# EAGLE design Water-Volume-Monitoring (EAGLE 6.3)
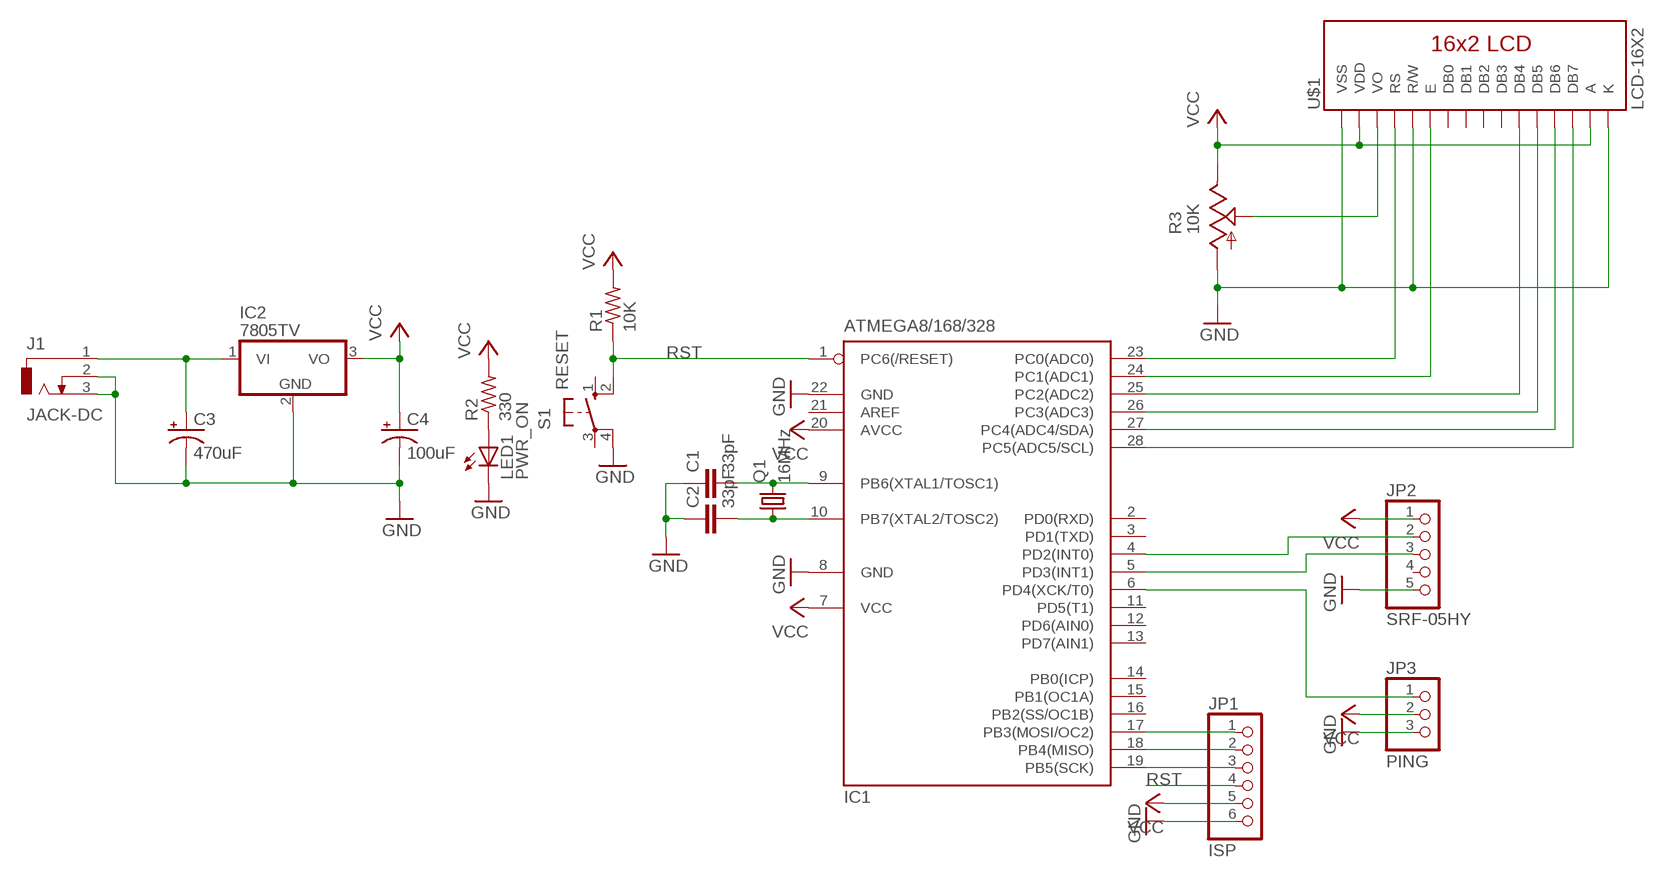
[diagram p0: schematic, sheet 1]

## Parts
C1  33pF  CAPACITOR-NONPOLAR025-024X044  [C025-024X044]
C2  33pF  CAPACITOR-NONPOLAR025-024X044  [C025-024X044]
C3  470uF  CAPACITOR-POLARE2.5-6  [E2,5-6]
C4  100uF  CAPACITOR-POLARE2.5-6  [E2,5-6]
IC1  ATMEGA8/168/328  [DIL28-3]
IC2  7805TV  [TO220V]
J1  JACK-DC  [DCJ0202]
JP1  ISP  PINHD-1X6  [1X06]
JP2  SRF-05HY  PINHD-1X5  [1X05]
JP3  PING  PINHD-1X3  [1X03]
LED1  PWR_ON  LED3MM  [LED3MM]
Q1  16MHz  CRYSTALHC49S  [HC49/S]
R1  10K  RESISTOR0207/10  [0207/10]
R2  330  RESISTOR0207/10  [0207/10]
R3  10K  TRIMPOTCA6V  [CA6V]
S1  RESET  SW-PUSHBUTTON  [B3F-10XX]
U$1  LCD-16X2  [LCD-16X2]

## Nets
GND: C1.1 C2.1 C3.- C4.- IC1.8(GND) IC1.22(GND) IC2.2(GND) J1.2 J1.3 JP1.6 JP2.5 JP3.3 LED1.K(C) R3.A S1.4(P1) U$1.1(VSS) U$1.5(R/W) U$1.16(K)
N$1: C1.2 IC1.9(PB6(XTAL1/TOSC1)) Q1.2
N$2: C2.2 IC1.10(PB7(XTAL2/TOSC2)) Q1.1
N$3: IC1.4(PD2(INT0)) JP2.2
N$4: C3.+ IC2.1(VI) J1.1
N$5: IC1.5(PD3(INT1)) JP2.3
N$6: IC1.6(PD4(XCK/T0)) JP3.1
N$8: LED1.A R2.1
N$9: R3.S U$1.3(VO)
N$10: IC1.23(PC0(ADC0)) U$1.4(RS)
N$11: IC1.24(PC1(ADC1)) U$1.6(E)
N$12: IC1.25(PC2(ADC2)) U$1.11(DB4)
N$13: IC1.26(PC3(ADC3)) U$1.12(DB5)
N$14: IC1.27(PC4(ADC4/SDA)) U$1.13(DB6)
N$15: IC1.28(PC5(ADC5/SCL)) U$1.14(DB7)
N$16: IC1.17(PB3(MOSI/OC2)) JP1.1
N$17: IC1.18(PB4(MISO)) JP1.2
N$18: IC1.19(PB5(SCK)) JP1.3
RST: IC1.1(PC6(/RESET)) JP1.4 R1.1 S1.2(S1)
VCC: C4.+ IC1.7(VCC) IC1.20(AVCC) IC2.3(VO) JP1.5 JP2.1 JP3.2 R1.2 R2.2 R3.E U$1.2(VDD) U$1.15(A)
Unconnected: IC1.2(PD0(RXD)) IC1.3(PD1(TXD)) IC1.11(PD5(T1)) IC1.12(PD6(AIN0)) IC1.13(PD7(AIN1)) IC1.14(PB0(ICP)) IC1.15(PB1(OC1A)) IC1.16(PB2(SS/OC1B)) IC1.21(AREF) JP2.4 S1.1(S) S1.3(P) U$1.7(DB0) U$1.8(DB1) U$1.9(DB2) U$1.10(DB3)

## Library data of the parts
C1 C2 = barelang-store:CAPACITOR-NONPOLAR: CAPACITOR, European symbol
C3 C4 = barelang-store:CAPACITOR-POLAR: POLARIZED CAPACITOR, American symbol
IC1 = barelang-store:ATMEGA8/168/328: MICROCONTROLLER 8 Kbytes FLASH, 1 kbytes SRAM, 512 bytes EEPROM, USART, 4-channel 10 bit ADC, 2-channel 8 bit ADC Pin compatible with Atmega48, ATMega88, ATMega168 Source: avr.lbr; OC_FARNELL: unknown; OC_NEWARK: unknown
IC2 = barelang-store:78*: Positive VOLTAGE REGULATOR Source: http://cache.national.com/ds/LM/LM78L05.pdf http://www.fairchildsemi.com/ds/LM/LM7805.pdf
J1 = barelang-store:JACK-DC: DC POWER JACK Source: DCJ0202.pdf; OC_FARNELL: unknown; OC_NEWARK: unknown
JP1 = barelang-store:PINHD-1X6: PIN HEADER
JP2 = barelang-store:PINHD-1X5: PIN HEADER
JP3 = barelang-store:PINHD-1X3: PIN HEADER
LED1 = barelang-store:LED: LED OSRAM: - CHIPLED LG R971, LG N971, LY N971, LG Q971, LY Q971, LO R971, LY R971 LH N974, LH R974 LS Q976, LO Q976, LY Q976 LO Q996 - Hyper CHIPLED LW Q18S LB Q993, LB Q99A, LB R99A - SideLED LS A670, LO A670, LY A670, LG A670, LP A670 LB A673, LV A673, LT A673, LW A673 LH A674 LY A675 LS A676, LA A676, LO A676, LY A676, LW A676 LS A679, LY A679, LG A679 - Hyper Micro SIDELED® LS Y876, LA Y876, LO Y876, LY Y876 LT Y87S - SmartLED LW L88C, LW L88S LB L89C, LB L89S, LG L890 LS L89K, LO L89K, LY L89K LS L896, LA L896, LO L896, LY L896 - TOPLED LS T670, LO T670, LY T670, LG T670, LP T670 LSG T670, LSP T670, LSY T670, LOP T670, LYG T670 LG T671, LOG T671, LSG T671 LB T673, LV T673, LT T673, LW T673 LH T674 LS T676, LA T676, LO T676, LY T676, LB T676, LH T676, LSB T676, LW T676 LB T67C, LV T67C, LT T67C, LS T67K, LO T67K, LY T67K, LW E67C LS E67B, LA E67B, LO E67B, LY E67B, LB E67C, LV E67C, LT E67C LW T67C LS T679, LY T679, LG T679 LS T770, LO T770, LY T770, LG T770, LP T770 LB T773, LV T773, LT T773, LW T773 LH T774 LS E675, LA E675, LY E675, LS T675 LS T776, LA T776, LO T776, LY T776, LB T776 LHGB T686 LT T68C, LB T68C - Hyper Mini TOPLED® LB M676 - Mini TOPLED Santana® LG M470 LS M47K, LO M47K, LY M47K Source: http://www.osram.convergy.de LUXEON: - LUMILED® LXK2-PW12-R00, LXK2-PW12-S00, LXK2-PW14-U00, LXK2-PW14-V00 LXK2-PM12-R00, LXK2-PM12-S00, LXK2-PM14-U00 LXK2-PE12-Q00, LXK2-PE12-R00, LXK2-PE12-S00, LXK2-PE14-T00, LXK2-PE14-U00 LXK2-PB12-K00, LXK2-PB12-L00, LXK2-PB12-M00, LXK2-PB14-N00, LXK2-PB14-P00, LXK2-PB14-Q00 LXK2-PR12-L00, LXK2-PR12-M00, LXK2-PR14-Q00, LXK2-PR14-R00 LXK2-PD12-Q00, LXK2-PD12-R00, LXK2-PD12-S00 LXK2-PH12-R00, LXK2-PH12-S00 LXK2-PL12-P00, LXK2-PL12-Q00, LXK2-PL12-R00 Source: www.luxeon.com KINGBRIGHT: KA-3528ASYC Source: www.kingbright.com
Q1 = barelang-store:CRYSTAL: CRYSTAL; OC_FARNELL: 1667008; OC_NEWARK: unknown
R1 R2 = barelang-store:RESISTOR: RESISTOR, American symbol
R3 = barelang-store:TRIMPOT: POTENTIOMETER
S1 = barelang-store:SW-PUSHBUTTON: OMRON SWITCH; MPN: B3F-1000; OC_FARNELL: 176432; OC_NEWARK: 36M3542
U$1 = barelang-store:LCD-16X2

## Board
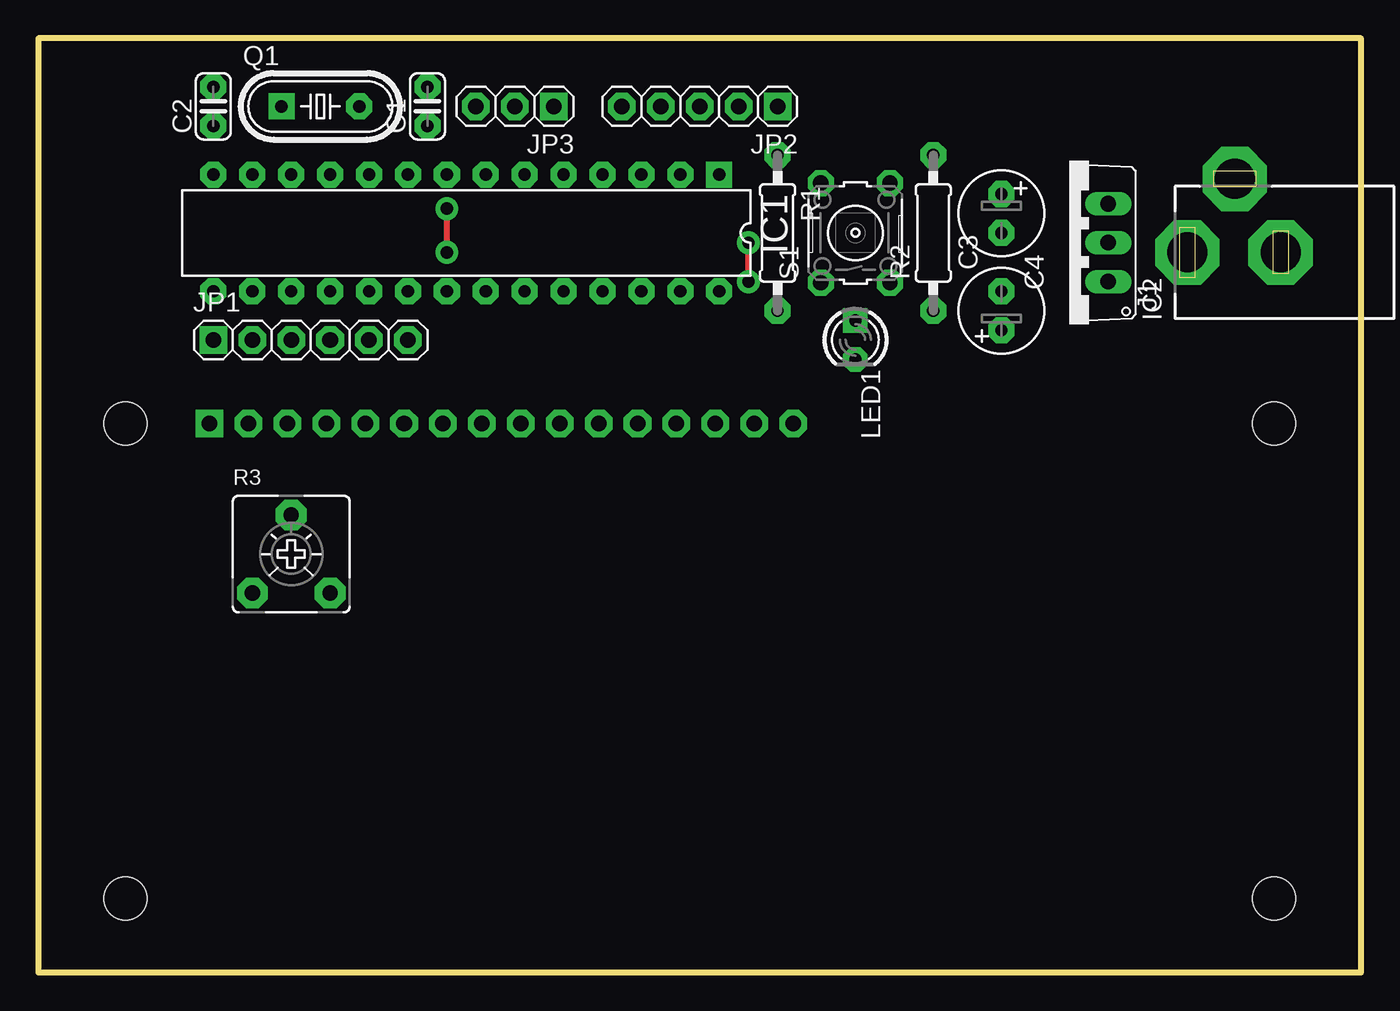
[diagram p1: board, top side]
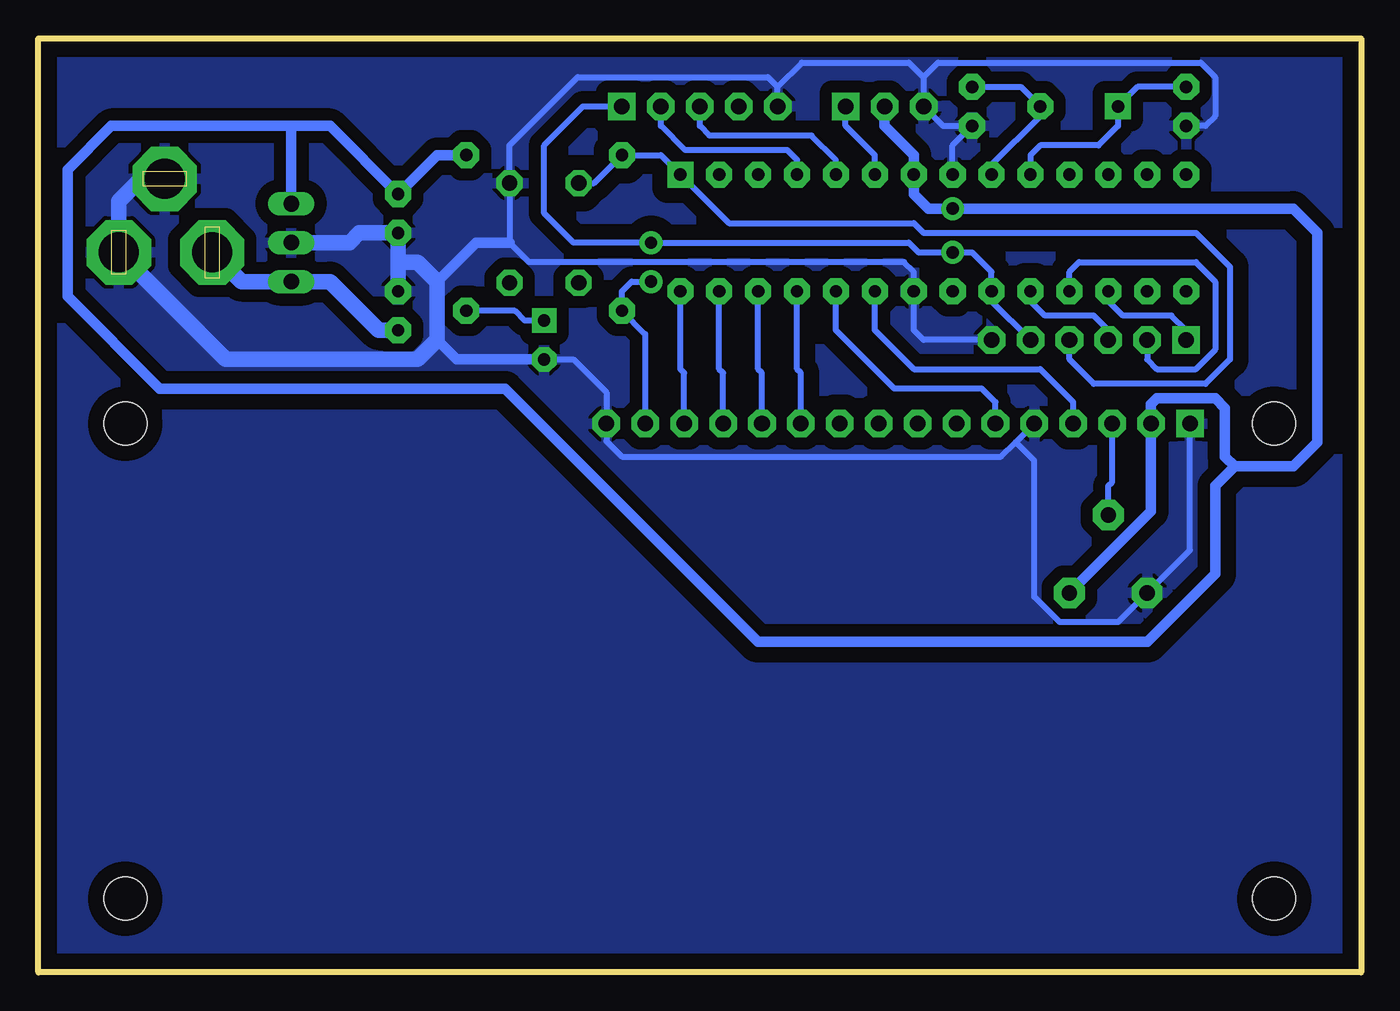
[diagram p2: board, bottom side, seen from below]

Size 86.36 x 60.96 mm. Coordinates in mm from the lower left corner, seen from the top.
Outline: 0,0 86.36,0 86.36,60.96 0,60.96 0,0
Copper layers (1*16): Top 0.035mm / dielectric 1.5mm / Bottom 0.035mm
Design rules "default": minimum track width 10mil, minimum drill 24mil, track to track 8mil, track to pad 8mil, pad to pad 8mil, via to via 8mil, smd to smd 8mil, copper to edge 40mil, drill to drill 8mil, minimum pad ring 10mil, minimum via ring 8mil, stop-mask expansion 4mil, vias tented up to drill 0mil, thermal gap 10mil

### Footprints (pad centres in the part's own frame; a part is rotated, then mirrored left to right if it is on the bottom)
C025-024X044 = drill 0.8 pad 1.7 octagon: 1 -1.27,0; 2 1.27,0
E2,5-6 = drill 0.8 pad 1.7 octagon: + -1.27,0; - 1.27,0
DIL28-3 = drill 0.8 pad 1.7 square: 1 -16.51,-3.81 | drill 0.8 pad 1.7 octagon: 2 -13.97,-3.81; 3 -11.43,-3.81; 4 -8.89,-3.81; 5 -6.35,-3.81; 6 -3.81,-3.81; 7 -1.27,-3.81; 8 1.27,-3.81; 9 3.81,-3.81; 10 6.35,-3.81; 11 8.89,-3.81; 12 11.43,-3.81; 13 13.97,-3.81; 14 16.51,-3.81; 15 16.51,3.81; 16 13.97,3.81; 17 11.43,3.81; 18 8.89,3.81; 19 6.35,3.81; 20 3.81,3.81; 21 1.27,3.81; 22 -1.27,3.81; 23 -3.81,3.81; 24 -6.35,3.81; 25 -8.89,3.81; 26 -11.43,3.81; 27 -13.97,3.81; 28 -16.51,3.81
TO220V = drill 1.016 long: 1 -2.54,-2.54; 2 0,-2.54; 3 2.54,-2.54
DCJ0202 = drill 2.6 pad 4.2 octagon: 1 0,3.1; 2 4.8,0; 3 0,-3
1X06 = drill 1.016 pad 1.8 square: 1 -6.35,0 | drill 1.016 pad 1.8 octagon: 2 -3.81,0; 3 -1.27,0; 4 1.27,0; 5 3.81,0; 6 6.35,0
1X05 = drill 1.016 pad 1.8 square: 1 -5.08,0 | drill 1.016 pad 1.8 octagon: 2 -2.54,0; 3 0,0; 4 2.54,0; 5 5.08,0
1X03 = drill 1.016 pad 1.8 square: 1 -2.54,0 | drill 1.016 pad 1.8 octagon: 2 0,0; 3 2.54,0
LED3MM = drill 0.8 pad 1.6 square: A -1.27,0 | drill 0.8 pad 1.6 octagon: K 1.27,0
HC49/S = drill 0.8 pad 1.7 square: 1 -2.54,0 | drill 0.8 pad 1.7 octagon: 2 2.54,0
0207/10 = drill 0.8 pad 1.7 octagon: 1 -5.08,0; 2 5.08,0
CA6V = drill 1 pad 2 octagon: A -2.54,-2.54; E 2.54,-2.54; S 0,2.54
B3F-10XX = drill 1 pad 1.7 octagon: 1 -3.251,2.261; 2 3.251,2.261; 3 -3.251,-2.261; 4 3.251,-2.261
LCD-16X2 = drill 1.016 pad 1.8 square: 1 -32,15.5 | drill 1.016 pad 1.8 octagon: 2 -29.46,15.5; 3 -26.92,15.5; 4 -24.38,15.5; 5 -21.84,15.5; 6 -19.3,15.5; 7 -16.76,15.5; 8 -14.22,15.5; 9 -11.68,15.5; 10 -9.14,15.5; 11 -6.6,15.5; 12 -4.06,15.5; 13 -1.52,15.5; 14 1.02,15.5; 15 3.56,15.5; 16 6.1,15.5 | hole 2.8: -37.5,15.5; -37.5,-15.5; 37.5,15.5; 37.5,-15.5

### Placement (x,y rotation side)
C1  25.4,56.52 90 top
C2  11.43,56.52 90 top
C3  62.87,43.18 90 top
C4  62.87,49.53 270 top
IC1  27.94,48.26 180 top
IC2  67.31,47.62 90 top
J1  78.11,46.99 90 top
JP1  17.78,41.27 0 top
JP2  43.18,56.52 180 top
JP3  31.11,56.52 180 top
LED1  53.34,41.27 270 top
Q1  18.41,56.52 0 top
R1  48.26,48.26 270 top
R2  58.42,48.26 90 top
R3  16.51,27.3 0 top
S1  53.34,48.26 90 top
U$1  43.18,20.32 0 top

### Tracks (layer width: path | path; a pad name or v marks a point on that pad's centre or on a via)
GND
  Bottom 0.4: C2.1 10.16,55.24 9.53,55.88 9.53,58.42 10.48,59.37 27.62,59.37 28.57,58.42 | U$1.1 11.18,27.55 R3.A 15.88,22.86 19.68,22.86 21.34,24.52 21.34,33.41 22.55,34.61 | IC1.8 26.67,53.98 C1.1 27.3,55.24 JP3.3 28.57,58.42 | 28.57,58.42 29.53,59.37 36.51,59.37 38.1,57.78 | LED1.K 51.44,40.01 49.28,37.85 U$1.16 49.28,34.67 48.26,33.66 23.5,33.66 22.55,34.61 | 22.55,34.61 U$1.5 | JP1.6 28.57,41.27 29.21,41.91 IC1.22 29.21,45.72 29.84,46.35 54.33,46.35 55.6,47.62 S1.4 55.6,53.98 51.16,58.42 38.73,58.42 38.1,57.78 | JP2.5 38.1,57.78
  Bottom 0.7: LED1.K 59.05,40.01 60.33,41.27 | 55.6,47.62 57.78,47.62 60.33,45.09
  Bottom 1: 62.87,46.35 61.59,46.35 60.33,45.09 60.33,41.27 61.59,40.01 74.12,40.01 J1.3 81.11,50.34 79.66,51.79 J1.2 | 62.87,46.35 C4.- 65.41,48.26 66.04,47.62 IC2.2 | 62.87,46.35 C3.-
  pour Bottom (isolate 0.8): 0,0 86.36,0 86.36,60.96 0,60.96
N$1
  Bottom 0.4: C1.2 22.23,57.78 Q1.2 20.95,55.88 24.13,52.7 IC1.9
N$2
  Bottom 0.4: C2.2 14.61,57.78 Q1.1 15.88,55.24 17.14,53.98 20.95,53.98 21.59,53.34 IC1.10
N$3
  Bottom 0.4: IC1.4 36.83,53.02 37.47,53.66 44.13,53.66 45.72,55.24 JP2.2
N$4
  Bottom 1: J1.1 73.1,45.09 IC2.1 67.31,45.09 64.14,41.91 C3.+
N$5
  Bottom 0.4: IC1.5 34.29,53.02 35.88,54.61 42.55,54.61 43.18,55.24 JP2.3
N$6
  Bottom 0.4: IC1.6 31.75,53.34 33.66,55.24 JP3.1
N$7
  pour Bottom (isolate 1): 0,0 86.36,0 86.36,60.96 0,60.96
N$8
  Bottom 0.4: LED1.A 54.61,42.55 55.24,43.18 R2.1
N$9
  Bottom 0.4: R3.S 16.51,31.75 16.26,32 U$1.3
N$10
  Bottom 0.4: U$1.4 18.8,37.22 20.95,39.37 29.21,39.37 31.75,41.91 IC1.23
N$11
  Bottom 0.4: U$1.6 23.88,37.22 24.77,38.1 30.48,38.1 34.29,41.91 IC1.24
N$12
  Bottom 0.4: U$1.11 36.58,39.12 36.83,39.37 IC1.25
N$13
  Bottom 0.4: U$1.12 39.12,39.12 39.37,39.37 IC1.26
N$14
  Bottom 0.4: U$1.13 41.66,39.12 41.91,39.37 IC1.27
N$15
  Bottom 0.4: U$1.14 44.2,39.12 44.45,39.37 IC1.28
N$16
  Bottom 0.4: JP1.1 11.43,41.91 12.38,42.86 15.56,42.86 16.51,43.81 IC1.17
N$17
  Bottom 0.4: JP1.2 13.97,40.01 13.34,39.37 10.79,39.37 9.53,40.64 9.53,45.09 10.79,46.35 18.41,46.35 19.05,45.72 IC1.18
N$18
  Bottom 0.4: JP1.3 16.51,41.91 17.46,42.86 20.64,42.86 21.59,43.81 IC1.19
RST
  Bottom 0.4: S1.2 50.09,51.51 R1.1 45.72,53.34 IC1.1 41.27,48.9 29.21,48.9 28.57,48.26 10.79,48.26 8.57,46.04 8.57,40.01 10.16,38.42 17.46,38.42 19.05,40.01 JP1.4
VCC  (via drill 0.8 pad 1.5)
  Top 0.4: v46.35,45.09 v46.35,47.62 | v26.67,46.99 v26.67,49.85
  Bottom 0.4: JP2.1 50.8,56.52 53.34,53.98 53.34,49.53 51.44,47.62 v46.35,47.62 29.53,47.62 28.89,46.99 v26.67,46.99 25.4,46.99 24.13,45.72 IC1.20 24.13,43.81 JP1.5 | U$1.15 46.74,41.66 R1.2 48.26,44.45 47.62,45.09 v46.35,45.09
  Bottom 0.7: 8.26,33.02 4.45,33.02 2.86,34.61 2.86,48.26 4.45,49.85 v26.67,49.85 28.26,49.85 29.21,50.8 IC1.7 29.21,53.34 31.11,55.24 JP3.2 | R2.2 60.33,53.34 C4.+ 67.31,55.24 69.85,55.24 | R3.E 13.72,30.09 U$1.2 13.72,37.08 13.34,37.47 9.53,37.47 8.89,36.83 8.89,33.66 8.26,33.02 | 69.85,55.24 IC2.3 | 69.85,55.24 81.6,55.24 84.45,52.39 84.45,44.13 78.42,38.1 55.88,38.1 39.37,21.59 13.97,21.59 9.53,26.04 9.53,31.75 8.26,33.02